# EAGLE design USB-FTDI-ESP (EAGLE 9.6.0)
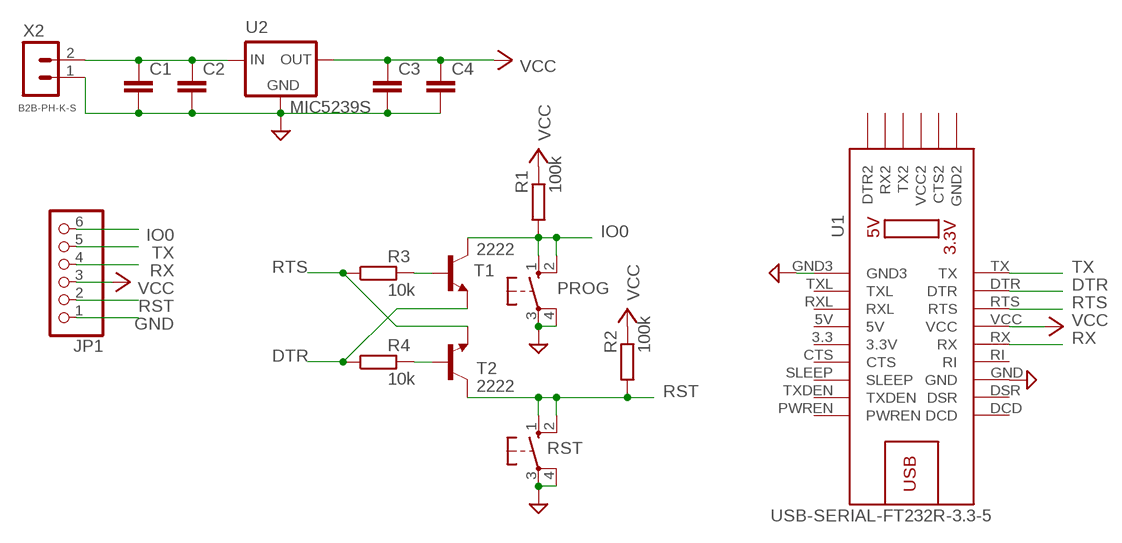
[diagram p0: schematic, sheet 1]

## Parts
C1  C-EUC1206K  [C1206K]
C2  C-EUC1206K  [C1206K]
C3  C-EUC1206K  [C1206K]
C4  C-EUC1206K  [C1206K]
JP1  PINHD-1X6  [1X06]
PROG  10-XX  [B3F-10XX]
R1  100k  RR1206  [R1206]
R2  100k  RR1206  [R1206]
R3  10k  RR1206  [R1206]
R4  10k  RR1206  [R1206]
RST  10-XX  [B3F-10XX]
T1  2222  MMBT2222ALT1-NPN-SOT23-BEC  [SOT23-BEC]
T2  2222  MMBT2222ALT1-NPN-SOT23-BEC  [SOT23-BEC]
U1  USB-SERIAL-FT232R-3.3-5  [USB-SERIAL-FT232R-3.3-5]
U2  MIC5239S  [SOT223]
X2  B2B-PH-K-S  [B2B-PH-K-S]

## Nets
DTR: R4.1 T1.E U1.DTR
GND: C1.2 C2.2 C3.2 C4.2 JP1.1 PROG.3(P) PROG.4(P1) RST.3(P) RST.4(P1) U1.GND U1.GND3 U2.2(GND) U2.4(GND) X2.1
IO0: JP1.6 PROG.1(S) PROG.2(S1) R1.1 T1.C
N$1: C1.1 C2.1 U2.1(IN) X2.2
N$10: R3.2 T1.B
N$14: R4.2 T2.B
RST: JP1.2 R2.1 RST.1(S) RST.2(S1) T2.C
RTS: R3.1 T2.E U1.RTS
RX: JP1.4 U1.RX
TX: JP1.5 U1.TX
VCC: C3.1 C4.1 JP1.3 R1.2 R2.2 U1.VCC U2.3(OUT)
Unconnected: U1.3.3(3.3V) U1.5V U1.CTS U1.CTS2 U1.DCD U1.DSR U1.DTR2 U1.GND2 U1.PWREN U1.RI U1.RX2 U1.RXL U1.SLEEP U1.TX2 U1.TXDEN U1.TXL

## Power pins joined to a net without a drawn wire
VCC2: U1.VCC2

## Library data of the parts
C1-C4 = rcl:C-EU: CAPACITOR, European symbol; SPICEPREFIX: C
JP1 = pinhead:PINHD-1X6: PIN HEADER
PROG RST = switch-omron:10-XX: OMRON SWITCH; MPN: B3F-1000; OC_FARNELL: 176432; OC_NEWARK: 36M3542
R1-R4 = eagle-ltspice:R: RESISTOR, European symbol; SPICEMODEL: NONE; SPICEPREFIX: R
T1 T2 = transistor:*-NPN-: NPN Transistror BF959 corrected 2008.03.06
U1 = diy-modules1.8-perso:USB-SERIAL-FT232R-3.3-5: USB to Serial UART Converter based on FT232R chip More information about FT232R chip is available here: http://www.ftdichip.com/Products/ICs/FT232R.htm
U2 = micrel:MIC5239S: LDO REGULATOR
X2 = con-JST PH:B2B-PH: JST PH series header 2.00mm pitch disconnectable crimp style connectors, vertical (side entry type), 2 pins

## Board
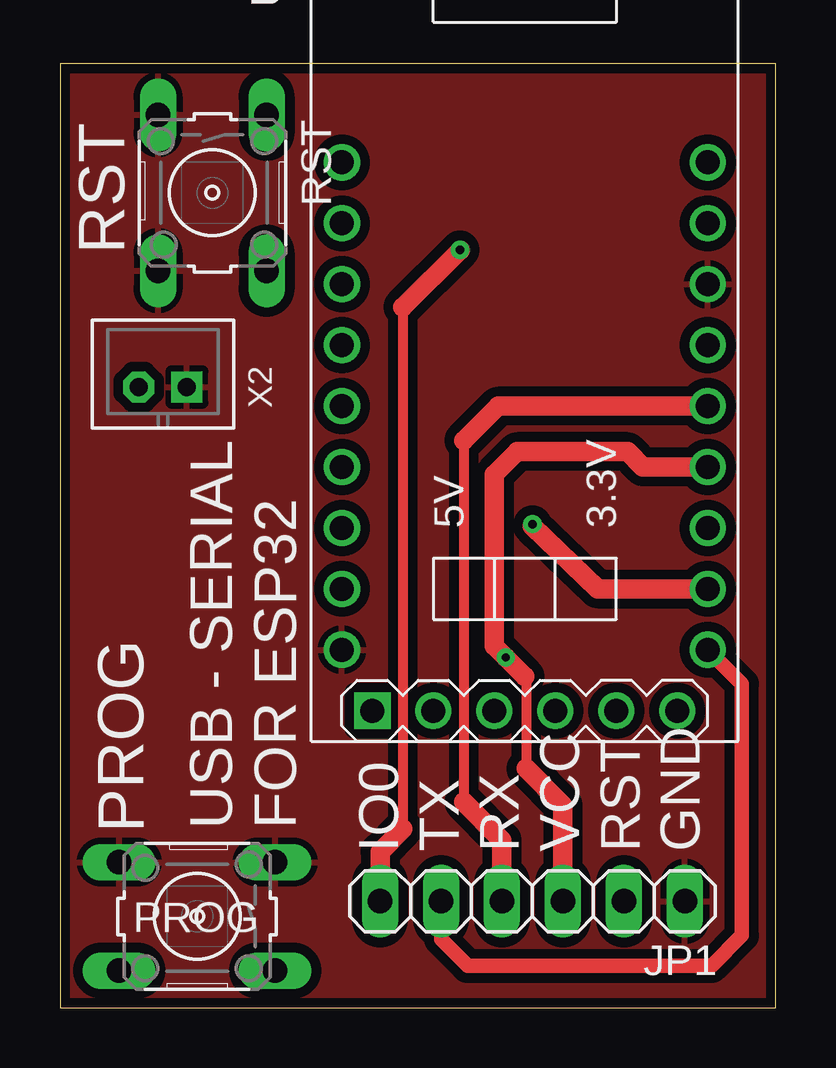
[diagram p1: board, top side]
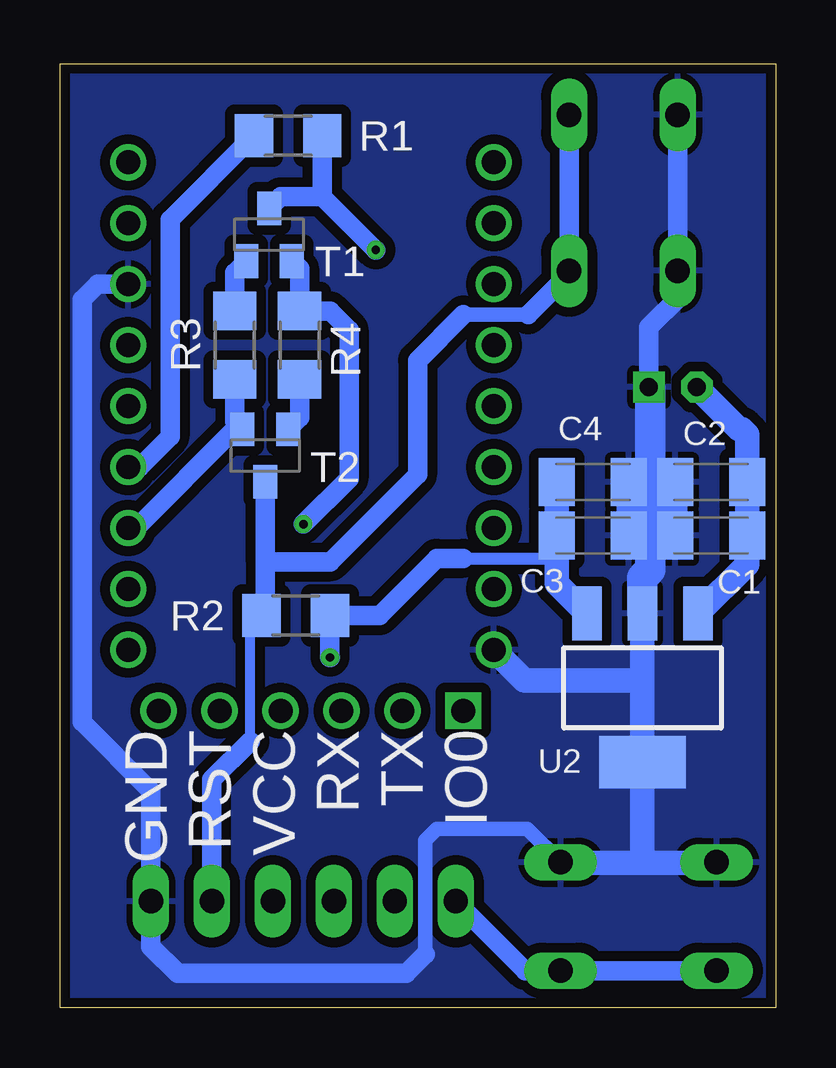
[diagram p2: board, bottom side, seen from below]

Size 29.82 x 39.36 mm. Coordinates in mm from the lower left corner, seen from the top.
Outline: 0,0 29.82,0 29.82,39.36 0,39.36 0,0
Copper layers (1*16): Top 0.035mm / dielectric 1.5mm / Bottom 0.035mm
Design rules "default *": minimum track width 6mil, minimum drill 0.35mm, track to track 6mil, track to pad 6mil, pad to pad 6mil, via to via 6mil, smd to smd 6mil, copper to edge 6mil, drill to drill 6mil, minimum pad ring 10mil, minimum via ring 8mil, stop-mask expansion 4mil, vias tented up to drill 0mil, thermal gap 10mil

### Footprints (pad centres in the part's own frame; a part is rotated, then mirrored left to right if it is on the bottom)
C1206K = smd 1.5 x 2: 1 -1.5,0; 2 1.5,0
1X06 = drill 1.016 long: 1 -6.35,0; 2 -3.81,0; 3 -1.27,0; 4 1.27,0; 5 3.81,0; 6 6.35,0
B3F-10XX = drill 1.016 long: 1 -3.251,2.261; 2 3.251,2.261; 3 -3.251,-2.261; 4 3.251,-2.261
R1206 = smd 1.6 x 1.803: 1 -1.422,0; 2 1.422,0
SOT23-BEC = smd 1 x 1.4: B -0.95,-1.1; C 0,1.1; E 0.95,-1.1
USB-SERIAL-FT232R-3.3-5 = drill 1: 3.3 -8.89,7.62; 5V -11.43,7.62; CTS -6.35,7.62; CTS2 -21.59,-3.81; DCD 1.27,-7.62; DSR -1.27,-7.62; DTR -16.51,-7.62; GND -3.81,-7.62; GND2 -21.59,-6.35; GND3 -19.05,7.62; PWREN 1.27,7.62; RI -6.35,-7.62; RTS -13.97,-7.62; RX -8.89,-7.62; RX2 -21.59,3.81; RXL -13.97,7.62; SLEEP -3.81,7.62; TX -19.05,-7.62; TX2 -21.59,1.27; TXDEN -1.27,7.62; TXL -16.51,7.62; VCC -11.43,-7.62; VCC2 -21.59,-1.27 | drill 1 square: DTR2 -21.59,6.35
SOT223 = smd 1.219 x 2.235: 1 -2.311,-3.099; 2 0,-3.099; 3 2.311,-3.099 | smd 3.6 x 2.2: 4 0,3.099
B2B-PH-K-S = drill 0.75 pad 1.3 square: 1 1,0 | drill 0.75 pad 1.3 octagon: 2 -1,0

### Placement (x,y rotation side)
C1  2.7,19.68 180 bottom
C2  2.7,21.91 180 bottom
C3  7.62,19.68 0 bottom
C4  7.62,21.91 0 bottom
JP1  19.68,4.45 180 top
PROG  5.71,3.81 180 top
R1  20.32,36.35 180 bottom
R2  20,16.35 0 bottom
R3  22.54,27.62 90 bottom
R4  19.84,27.62 270 bottom
RST  6.35,33.97 270 top
T1  21.11,32.23 0 bottom
T2  21.27,23.02 180 bottom
U1  19.37,33.97 90 top
U2  5.56,13.34 180 bottom
X2  4.29,25.88 0 top

### Tracks (layer width: path | path; a pad name or v marks a point on that pad's centre or on a via)
DTR  (via drill 0.35)
  Top 0.152: v19.68,20.16 19.68,20.09 | 19.68,20.09
  Top 0.813: 19.68,20.09 22.41,17.46 U1.DTR
  Bottom 0.813: T1.E 19.84,30.81 R4.1 18.57,29.04 17.78,28.26 17.78,22.07 v19.68,20.16
GND
  Bottom 0.61: 14.61,2.22 14.61,6.99 14.13,7.46 10.36,7.46 8.93,6.03
  Bottom 0.813: C3.2 5.96,19.53 5.24,19.53 5.08,19.68 C1.2 | C4.2 5.24,21.91 C2.2 | X2.1 5.29,28.37 3.97,29.69 3.97,30.6 RST.4 RST.3 | 14.61,2.22 15.4,1.43 24.92,1.43 26.04,2.54 JP1.1 26.04,9.05 28.89,11.91 28.89,29.53 28.26,30.16 U1.GND
  Bottom 1.016: C2.2 C1.2 | C4.2 C3.2 | U2.2 5.56,13.65 | 5.56,13.65 U2.4 5.56,6.03 | U1.GND3 10.48,13.65 5.56,13.65 | 5.56,6.03 2.5,6.03 PROG.4 | 5.56,6.03 8.93,6.03 PROG.3
  Bottom 1.27: U2.2 5.56,17.94 5.24,18.26 5.24,19.53 5.24,21.91 5.24,25.83 X2.1
  pour Top (isolate 0.406): 0,39.37 29.84,39.37 29.84,0 0,0
  pour Bottom (isolate 0.406): 0,39.37 29.84,39.37 29.84,0 0,0
IO0  (via drill 0.35)
  Top 0.406: 14.29,29.21 14.29,7.46
  Top 0.813: v16.67,31.59 14.29,29.21 | 14.29,7.46 13.34,6.51 JP1.6
  Bottom 0.813: T1.C 20.64,33.8 18.9,33.8 R1.1 18.9,33.82 v16.67,31.59 | PROG.2 PROG.1 10.44,1.55 JP1.6
N$1
  Bottom 1.016: X2.2 1.54,24.13 1.43,24.13 1.2,23.9 C2.1 C1.1 1.2,18.48 U2.1
N$10
  Bottom 0.813: T1.B 22.54,30.65 R3.2
N$14
  Bottom 0.813: R4.2 19.84,24.6 T2.B
RST
  Bottom 0.406: 21.91,11.11 21.91,15.88
  Bottom 0.61: 10.32,28.89 13.02,28.89 | 21.91,15.88 21.43,16.35 R2.1
  Bottom 0.813: R2.1 21.43,16.36 21.27,16.52 T2.C 21.27,18.59 18.56,18.59 14.92,22.23 14.92,26.99 13.02,28.89 | 21.91,11.11 23.5,9.53 JP1.2 | RST.1 RST.2 8.61,30.6 10.32,28.89
RTS
  Bottom 0.813: R3.1 22.54,24.44 T2.E 22.54,24.12 26.66,20 U1.RTS
RX
  Top 0.406: 16.83,23.65 16.83,8.57
  Top 0.813: U1.RX 18.26,25.08 16.83,23.65 | 16.83,8.57 18.41,6.99 JP1.4
TX
  Top 0.61: JP1.5 15.88,2.86 16.99,1.75 27.15,1.75 28.42,3.02 28.42,13.49 U1.TX
VCC  (via drill 0.35)
  Top 0.406: 19.43,13.75 19.43,9.98
  Top 0.61: 19.37,13.81 19.43,13.75
  Top 0.813: U1.VCC 24.29,22.54 23.65,23.18 19.05,23.18 18.1,22.23 18.1,15.08 v18.57,14.61 19.37,13.81 | JP1.3 20.95,8.45 19.43,9.98
  Bottom 0.508: 13.02,18.73 9.12,18.73
  Bottom 0.813: 13.02,18.73 14.13,18.73 16.51,16.35 R2.2 v18.58,14.61 v18.57,14.61 | R1.2 25.24,32.85 25.24,23.81 26.51,22.54 U1.VCC
  Bottom 1.016: C4.1 C3.1 9.12,18.73 9.12,17.69 U2.3

### Text on the board
tNames: RST | PROG | USB - SERIAL / FOR ESP32 | IO0 / TX / RX / VCC / RST / GND
bNames: GND / RST / VCC / RX / TX / IO0